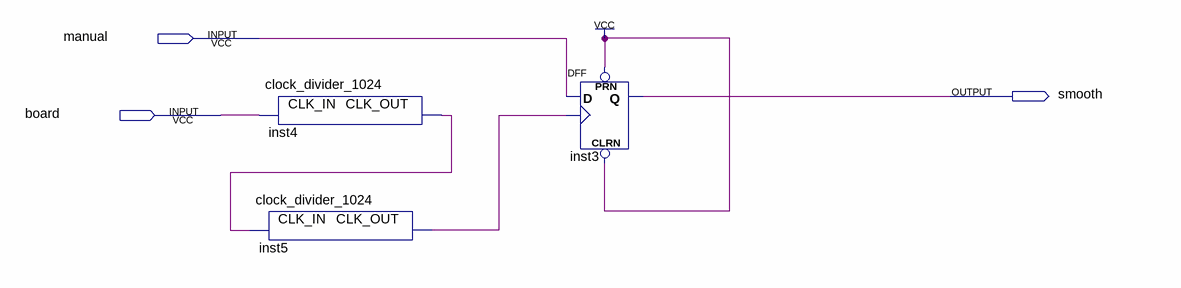
[diagram p0: schematic sheet]
// Quartus schematic debouncer.bdf as structural Verilog: 3 symbols, 3 pins
module debouncer (
  input  manual,
  input  board,
  output smooth
);

  wire inst4_clk_out, inst5_clk_out;

  clock_divider_1024 inst4 (.CLK_IN(board), .CLK_OUT(inst4_clk_out));
  clock_divider_1024 inst5 (.CLK_IN(inst4_clk_out), .CLK_OUT(inst5_clk_out));
  DFF inst3 (.CLRN(1'b1), .CLK(inst5_clk_out), .D(manual), .PRN(1'b1), .Q(smooth));
endmodule
